# EAGLE design BMS Test Board rev3 (EAGLE 9.6.2)
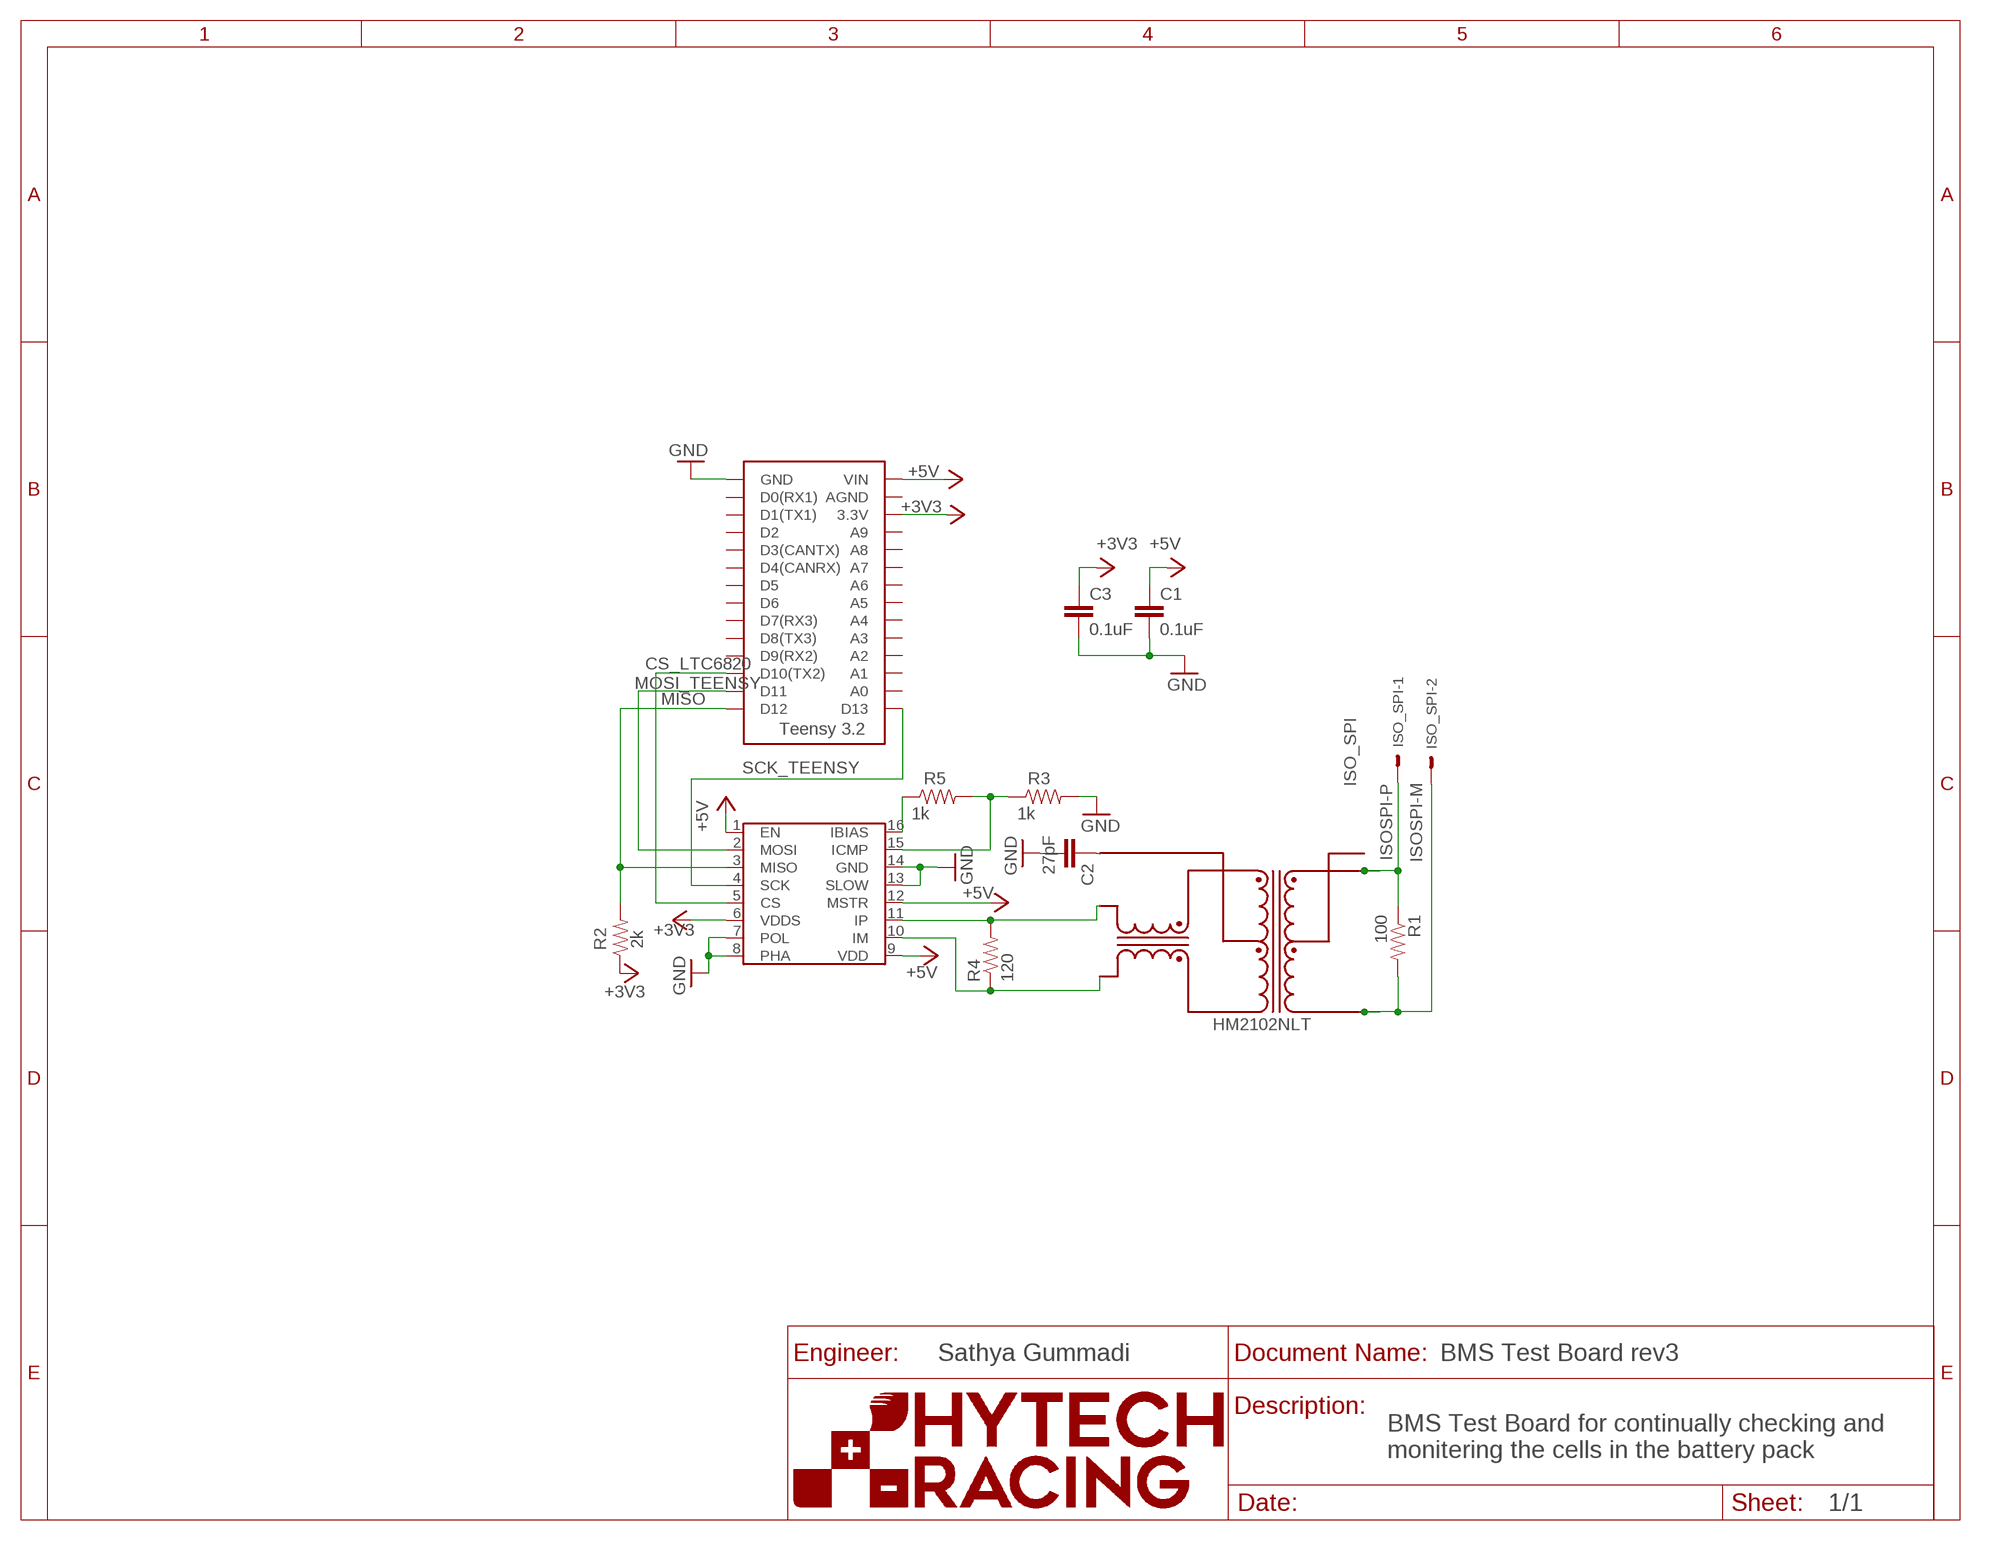
[diagram p0: schematic, sheet 1]
U$4 (FRAME_A_L): ORIENTATION: LANDSCAPE; SIZE: A

## Parts
C1  0.1uF  CAP0603-CAP  [0603-CAP]
C2  27pF  CAP0603-CAP  [0603-CAP]
C3  0.1uF  CAP0603-CAP  [0603-CAP]
ISO_SPI  ISO_SPI  CONNECTOR-2NANO-FIT_VERTICAL-2  [NANO-FIT_VERTICAL-2]
R1  100  RESISTOR0603-RES  [0603-RES]
R2  2k  RESISTOR0603-RES  [0603-RES]
R3  1k  RESISTOR0603-RES  [0603-RES]
R4  120  RESISTOR0603-RES  [0603-RES]
R5  1k  RESISTOR0603-RES  [0603-RES]
U$1  HM2102NLT  [HM2102NLT]
U$2  LTC6820  [MSOP-16]
U$3  TEENSY_3.2_SIMPLE  [TEENSY_3.2_SIMPLE]

## Nets
+3V3: C3.2 R2.1 U$2.6(VDDS) U$3.3.3V
+5V: C1.2 U$2.1(EN) U$2.9(VDD) U$2.12(MSTR) U$3.VIN
CS_LTC6820: U$2.5(CS) U$3.D10(TX2)
GND: C1.1 C2.2 C3.1 R3.2 U$2.7(POL) U$2.8(PHA) U$2.13(SLOW) U$2.14(GND) U$3.GND
IM: R4.1 U$1.P$10(TD-) U$2.10(IM)
IP: R4.2 U$1.P$12(TD+) U$2.11(IP)
ISOSPI-M [ISO_SPI]: ISO_SPI.P$2 R1.2 U$1.P$3(MX-)
ISOSPI-P [ISO_SPI]: ISO_SPI.P$1 R1.1 U$1.P$1(MX+)
MISO: R2.2 U$2.3(MISO) U$3.D12
MOSI_TEENSY: U$2.2(MOSI) U$3.D11
N$1: C2.1 U$1.P$11(TCT)
N$31: R5.1 U$2.16(IBIAS)
N$32: R3.1 R5.2 U$2.15(ICMP)
SCK_TEENSY: U$2.4(SCK) U$3.D13
Unconnected: U$1.P$2(MCT) U$1.P$4(MX+) U$1.P$5(MCT) U$1.P$6(MX-) U$1.P$7(TD-) U$1.P$8(TCT) U$1.P$9(TD+) U$3.A0 U$3.A1 U$3.A2 U$3.A3 U$3.A4 U$3.A5 U$3.A6 U$3.A7 U$3.A8 U$3.A9 U$3.AGND U$3.D0(RX1) U$3.D1(TX1) U$3.D2 U$3.D3(CANTX) U$3.D4(CANRX) U$3.D5 U$3.D6 U$3.D7(RX3) U$3.D8(TX3) U$3.D9(RX2)

## Notes on the sheet
- Sathya Gummadi
- BMS Test Board for continually checking and
  monitering the cells in the battery pack

## Library data of the parts
C1-C3 = HyTechDevices:CAP: Capacitor Standard 0603 ceramic capacitor, and 0.1" leaded capacitor.
ISO_SPI = HyTechDevices:CONNECTOR-2: Mini-Fit Junior connector 2 pole Source: http://www.molex.com
R1-R5 = HyTechDevices:RESISTOR: Resistor Basic schematic elements and footprints for 0603, 1206, and PTH resistors.
U$1 = HyTechDevices:HM2102NLT: 2 Channel SMT Transformer Turns ratio: 1CT: 1CT Isolation Voltage: 4300 VDC Inductance: 150 uH Leakage Inductance: 0.50 uH max DataSheet <https://www.mouser.com/datasheet/2/336/HM2102NL-1218600.pdf>
U$2 = HyTechDevices:LTC6820: Linear Technology isoSPI Isolated Communications Interface Datasheet <http://cds.linear.com/docs/en/datasheet/6820fb.pdf>
U$3 = HyTechDevices:TEENSY_3.2_SIMPLE: Simple version of the Teensy 3.2 board that only uses the 2 main rows of pins, not the inner pins or the pins opposite the usb port.

## Net classes
2 ISO_SPI: clearance 8.5 mm to class 0, clearance 8.5 mm to class 1

## Board
The BMS Test Board (rev3) is used for continually checking and monitering the cells in the battery pack. The Teensy 3.2 takes the inputs from the battery and works accordingly, and it is powered by 5V from the USB port. The LTC6820 is used for converting the SPI communication from the Teensy to an IsoSPI communication (so that we can send the signal with the HM2102NLT transformer to the LTC6811 on the other side). The HM2102NLI transformer is used for isolating the board from the battery pack to protect both devices from voltage swings that can be caused by system noise, which can mess with the inputs and outputs.
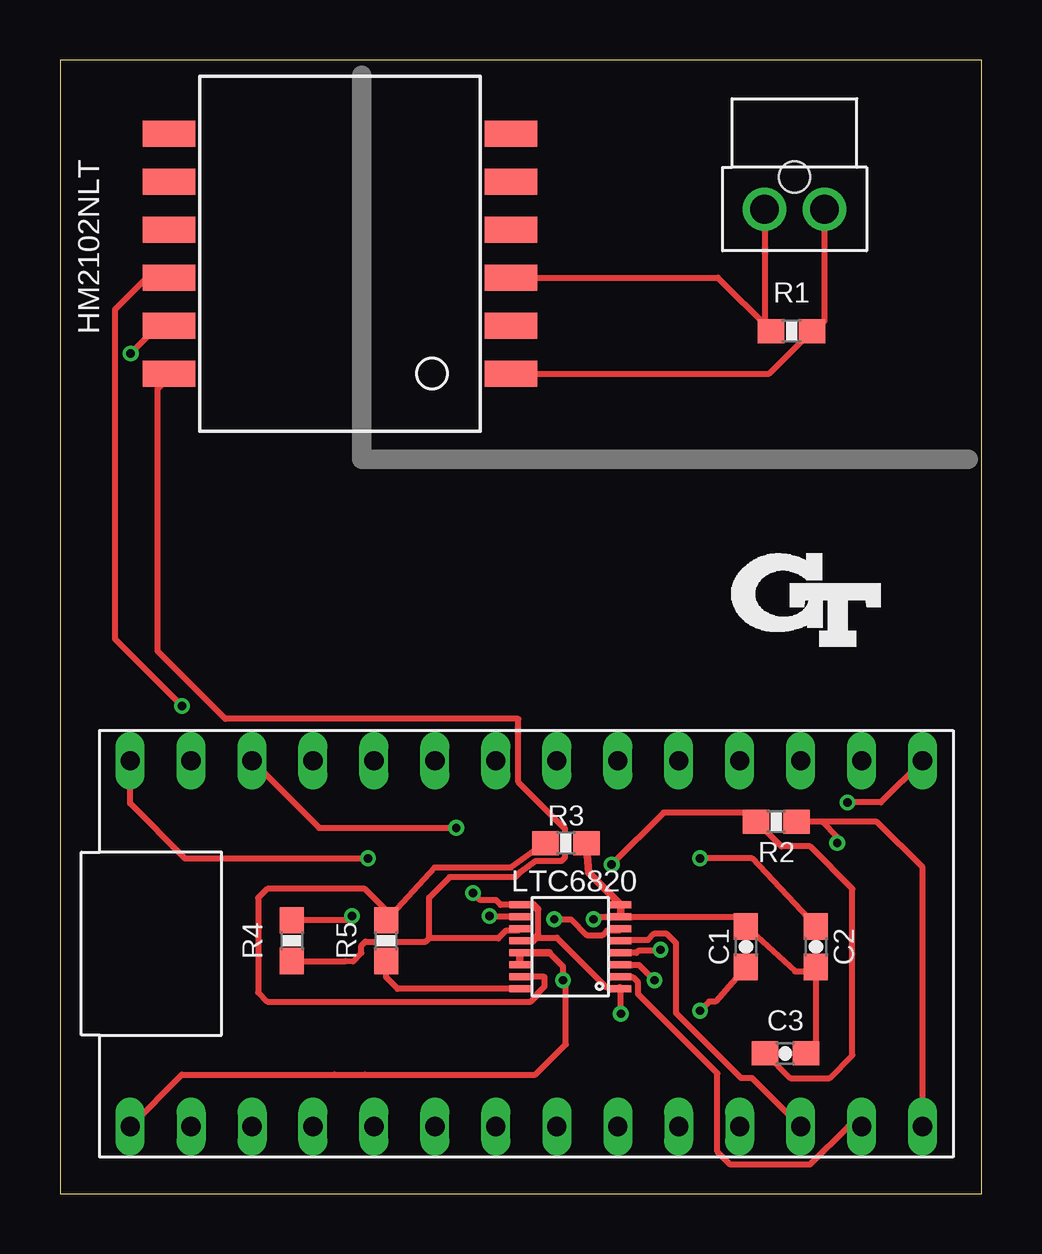
[diagram p1: board, top side]
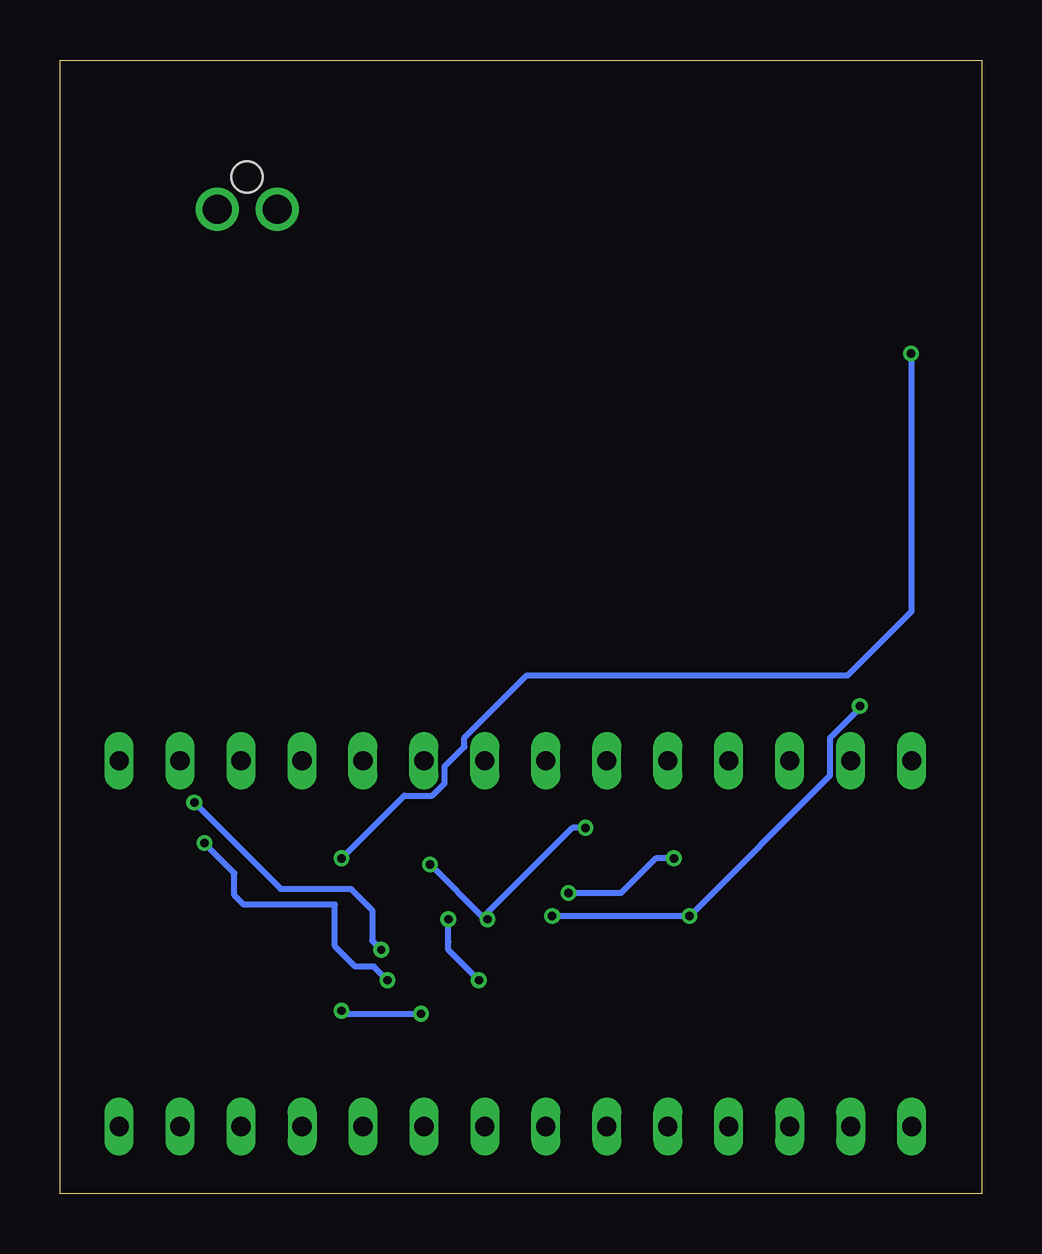
[diagram p2: board, bottom side, seen from below]

Size 38.41 x 47.23 mm. Coordinates in mm from the lower left corner, seen from the top.
Outline: 0,0 38.41,0 38.41,47.23 0,47.23 0,0
Copper layers (1*16): Top 0.035mm / dielectric 1.53mm / Bottom 0.035mm
Design rules "JLCPCB (2 Layer)": minimum track width 5mil, minimum drill 0.3mm, track to track 5mil, track to pad 5mil, pad to pad 5mil, via to via 20mil, smd to smd 5mil, copper to edge 0.2mm, drill to drill 21mil, minimum pad ring 6mil, minimum via ring 6mil, stop-mask expansion 6mil, vias tented up to drill 30mil, thermal gap 10mil

### Footprints (pad centres in the part's own frame; a part is rotated, then mirrored left to right if it is on the bottom)
0603-CAP = smd 1.1 x 1: 1 -0.85,0; 2 0.85,0
NANO-FIT_VERTICAL-2 = drill 1.2: P$1 -1.25,0; P$2 1.25,0 | hole 1.3: 0,-1.34
0603-RES = smd 1.1 x 1: 1 -0.85,0; 2 0.85,0
HM2102NLT = smd 1.067 x 2.184: P$1 0,0; P$2 2,0; P$3 4,0; P$4 6,0; P$5 8,0; P$6 10,0; P$7 10,14.25; P$8 8,14.25; P$9 6,14.25; P$10 4,14.25; P$11 2,14.25; P$12 0,14.25
MSOP-16 = smd 0.305 x 0.889: 1 -0.1,-0.5; 2 0.4,-0.5; 3 0.9,-0.5; 4 1.4,-0.5; 5 1.9,-0.5; 6 2.4,-0.5; 7 2.9,-0.5; 8 3.4,-0.5; 9 3.4,3.7; 10 2.9,3.7; 11 2.4,3.7; 12 1.9,3.7; 13 1.4,3.7; 14 0.9,3.7; 15 0.4,3.7; 16 -0.1,3.7
TEENSY_3.2_SIMPLE = drill 0.8 long: 3.3V 16.51,29.21; A0 16.51,3.81; A1 16.51,6.35; A2 16.51,8.89; A3 16.51,11.43; A4 16.51,13.97; A5 16.51,16.51; A6 16.51,19.05; A7 16.51,21.59; A8 16.51,24.13; A9 16.51,26.67; AGND 16.51,31.75; D0(RX1) 1.27,31.75; D1(TX1) 1.27,29.21; D2 1.27,26.67; D3(CANTX) 1.27,24.13; D4(CANRX) 1.27,21.59; D5 1.27,19.05; D6 1.27,16.51; D7(RX3) 1.27,13.97; D8(TX3) 1.27,11.43; D9(RX2) 1.27,8.89; D10(TX2) 1.27,6.35; D11 1.27,3.81; D12 1.27,1.27; D13 16.51,1.27; GND 1.27,34.29; VIN 16.51,34.29

### Placement (x,y rotation side)
C1  28.57,10.29 270 top
C2  31.5,10.29 270 top
C3  30.23,5.84 180 top
ISO_SPI  30.61,41.02 180 top
R1  30.48,35.94 180 top
R2  29.84,15.49 0 top
R3  21.08,14.61 0 top
R4  9.65,10.54 270 top
R5  13.59,10.54 90 top
U$1  18.8,34.16 90 top
U$2  22.86,8.64 90 top
U$3  37.21,1.52 90 top

### Tracks (layer width: path | path; a pad name or v marks a point on that pad's centre or on a via)
+3V3  (via drill 0.35)
  Top 0.254: U$3.3.3V 10.79,15.24 v16.51,15.24 | U$2.6 23.29,10.97 22.8,10.97 22.6,10.77 21.95,10.77 21.3,11.43 v20.59,11.43 | C3.2 29.41,5.84 30.43,4.81 32.07,4.81 33.02,5.77 33.02,12.7 31.25,14.46 30.05,14.46 29.02,15.49 | 29.02,15.49 R2.1 | 29.02,15.49 28.64,15.88 25.15,15.88 v22.99,13.72
  Bottom 0.254: v16.51,15.24 17.06,15.24 20.57,11.72 20.57,11.43 v20.59,11.43 20.7,11.43 v22.99,13.72
+5V  (via drill 0.35)
  Top 0.254: 19.71,12.04 U$2.9 18.36,12.04 18.17,12.22 17.51,12.22 v17.21,12.53 | 23.32,8.58 22.79,8.58 20.7,10.66 19.82,10.66 | 19.91,11.84 19.91,10.76 | U$3.VIN 2.92,16.26 5.21,13.97 v12.83,13.97 | C1.2 27.31,8 27.05,8 v26.67,7.62 | 23.36,7.5 U$2.1
  Top 0.305: 19.91,10.76 19.82,10.66 19.69,10.54 U$2.12 | 23.32,8.58 U$2.1 | 19.71,12.04 19.91,11.84 | v23.37,7.49 23.36,7.5
  Bottom 0.254: 26.54,7.49 v23.37,7.49 | v12.83,13.97 13.59,13.97 15.03,12.53 v17.21,12.53
  Bottom 0.305: v26.67,7.62 26.54,7.49
CS_LTC6820
  Top 0.254: U$3.D10(TX2) 28.84,4.81 28.39,4.81 25.68,7.52 25.68,10.43 25.29,10.82 24.75,10.82 24.49,10.56 23.39,10.56 U$2.5
GND  (via drill 0.35)
  Top 0.254: 22.33,11.54 U$2.7 28.35,11.54 | U$3.GND 5.08,4.95 11.43,4.95 12.7,4.95 19.81,4.95 21.08,6.22 21.08,8.76 | C1.1 30.62,9.26 31.32,9.26 | 20.39,10.04 20.95,9.47 v20.95,8.89 | C2.2 31.5,6.26 C3.1
  Top 0.305: U$2.7 U$2.8 22.04,13.36 R3.2 | U$2.14 U$2.13 20.39,10.04 | v22.23,11.43 22.33,11.54 | 28.35,11.54 C1.1 | 21.08,8.76 v20.95,8.89
  Top 0.508: 31.32,9.26 C2.2
  Bottom 0.254: v22.23,11.43 22.23,10.49 22.23,10.16 v20.95,8.89
IM  (via drill 0.35)
  Top 0.254: v17.9,11.57 19.13,11.57 U$2.10 | v12.17,11.57 12,11.39 R4.1 | U$1.P$10 3.62,38.16 2.29,36.83 2.29,23.11 v5.08,20.32
  Bottom 0.254: v17.9,11.57 v12.17,11.57 6.32,17.42 6.32,18.99 5.08,20.22 v5.08,20.32
IP
  Top 0.254: R4.2 11.9,9.69 12.2,9.67 12.56,10.03 12.56,10.33 12.72,10.49 15.24,10.49 15.38,10.63 | U$2.11 19.09,10.97 18.6,10.97 18.27,10.63 15.38,10.63 | 15.38,10.63 15.38,12.33 16.23,13.18 18.96,13.18 19.18,13.39 19.81,13.85 20.89,13.85 21.04,14 21.04,15.21 20.89,15.36 20.88,15.36 19.09,17.14 19.09,19.79 6.88,19.79 4.06,22.61 4.06,33.53 4.55,34.01 U$1.P$12
ISOSPI-M
  Top 0.254: 29.57,36.01 29.36,36.23 ISO_SPI.P$2 | 29.57,36.01 R1.2 | U$1.P$3 27.41,38.16 29.57,36.01
ISOSPI-P
  Top 0.254: ISO_SPI.P$1 31.86,36.36 31.57,36.13 R1.1 29.55,34.16 U$1.P$1
MISO  (via drill 0.35)
  Top 0.254: U$3.D12 35.94,13.59 34.04,15.49 31.75,15.49 | 31.75,15.49 R2.2 | v32.38,14.61 32.38,14.86 31.75,15.49 | U$2.3 24.12,9.54 v24.77,8.89
  Bottom 0.254: v32.38,14.61 31.14,13.36 31.14,12.43 30.75,12.04 26.95,12.04 26.95,10.31 26.09,9.46 25.33,9.46 v24.77,8.89
MOSI_TEENSY
  Top 0.254: U$2.2 23.39,9.01 23.88,9.01 24.08,8.8 24.08,8.31 27.39,5.01 27.39,1.75 27.93,1.21 31.25,1.21 32.84,2.79 U$3.D11
N$1  (via drill 0.35)
  Top 0.254: C2.1 28.84,13.97 v26.67,13.97 | v2.94,35.01 4.1,36.16 U$1.P$11
  Bottom 0.254: v26.67,13.97 24.06,16.58 22.89,16.58 22.39,17.08 22.39,17.78 21.55,18.61 21.55,18.99 18.95,21.59 5.59,21.59 2.92,24.26 2.92,34.99 v2.94,35.01
N$31
  Top 0.254: U$2.16 14.07,8.54 13.59,9.02 R5.1
N$32
  Top 0.254: R3.1 20.2,14.61 18.8,13.59 15.61,13.59 R5.2 13.59,11.81 12.7,12.7 8.64,12.7 8.26,12.32 8.26,8.38 8.64,8 19.62,8 19.88,8.27 19.88,8.33 20.19,8.64 20.19,9.02 20.17,9.04 U$2.15
SCK_TEENSY  (via drill 0.35)
  Top 0.254: U$3.D13 34.2,16.3 v32.81,16.3 | U$2.4 24.01,10.04 24.09,10.11 24.97,10.11 v25.02,10.16
  Bottom 0.254: v32.81,16.3 29.21,12.7 26.29,12.7 25.4,11.81 25.4,10.54 v25.02,10.16

### Text on the board
tNames: HM2102NLT | LTC6820
tDocu: 2020 BMS / Test Board rev3 | isoSPI | Designed By: Sathya Gummadi | GLV